# Altium project inverter_board.PrjPcb
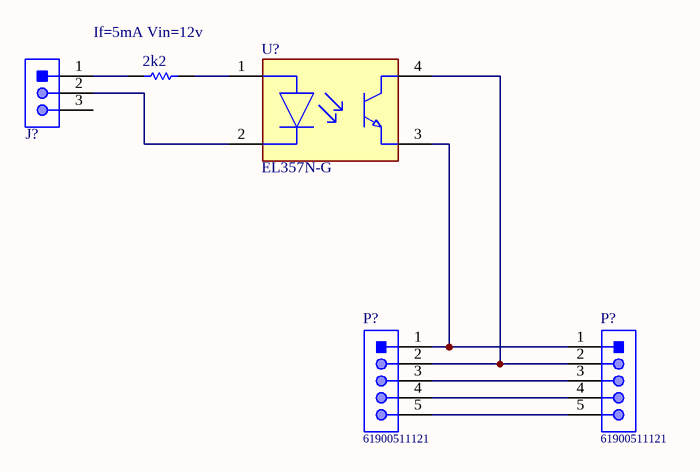
[diagram p0: inverter_board.SchDoc]
1 sheet, 5 parts. Net scope: global (net labels, ports and power ports of the same name join across sheets).
Board file: inverter_board.PcbDoc

## Sheet inverter_board.SchDoc
size A4

### Parts
(Parts that share a designator on the sheet are numbered #1, #2 ... from top to bottom, then left to right.)
2k2  RC0402JR-070RL  [RESC1005X40X25NL05T10]  (value not drawn)
J?  JST-S3B-PH-SM4-TB-3_V  [JST-S3B-PH-SM4-TB-3_V]  (value not drawn)
P?#1  61900511121  [61900511121]
P?#2  61900511121  [61900511121]
U?  EL357N-G  [SOP-4_4mm]

### Nets
Net2k2_1: 2k2.1 J?.1
Net2k2_2: 2k2.2 U?.1(A)
NetJ?_2: J?.2 U?.2(C)
NetP?#1_1: P?#1.1 P?#2.1 U?.3(E)
NetP?#1_2: P?#1.2 P?#2.2 U?.4(C)
NetP?#1_3: P?#1.3 P?#2.3
NetP?#1_4: P?#1.4 P?#2.4
NetP?#1_5: P?#1.5 P?#2.5

Not connected (* = marked no-connect by the designer): J? 3

### Notes on the sheet
- If=5mA Vin=12v

### Library data of the parts
2k2 = CMP-1011-00001-2: Manufacturer: Yageo / Phycomp; Part Number: RC0402JR-070RL
J? = CONNECTOR_JST-S3B-PH-SM4
P?#1 P?#2 = CMP-1502-00587-1: Male Locking Header WR-WTB, THT, Vertical, pitch 2.54 mm, 1 x 5 position; Manufacturer: Wurth Elektronik; Pitch: 2.54mm; Contact Resistance: 20mOhm; Position: 1x5; Working Voltage: 250VAC; Publisher: WurthElektronik; Datasheet URL: https://katalog.we-online.de/em/datasheet/6190xx11121.pdf; Part Number: 61900511121; Manufacturer URL: http://www.we-online.de; Gender: Male; Mounting Technology: THT; Package Reference: 61900511121; Operating Temperature: -40to105degC; Orientation: Vertical; Packaging: Bag
U? = OPTOCOUPLER_EL357N-G: 4 PIN SOP PHOTOTRANSISTOR PHOTOCOUPLER / CTR: 50~600% at IF =5mA, VCE =5V / 4 Pin SOP with a 2.0 mm profile; ComponentLink1Description: Datasheet; ComponentLink1URL: https://www.mouser.com/datasheet/2/143/201407061738295695-365680.pdf